# Altium schematic sheet TopLevel.SchDoc
size A4; SheetNumber: 1; SheetTotal: 8
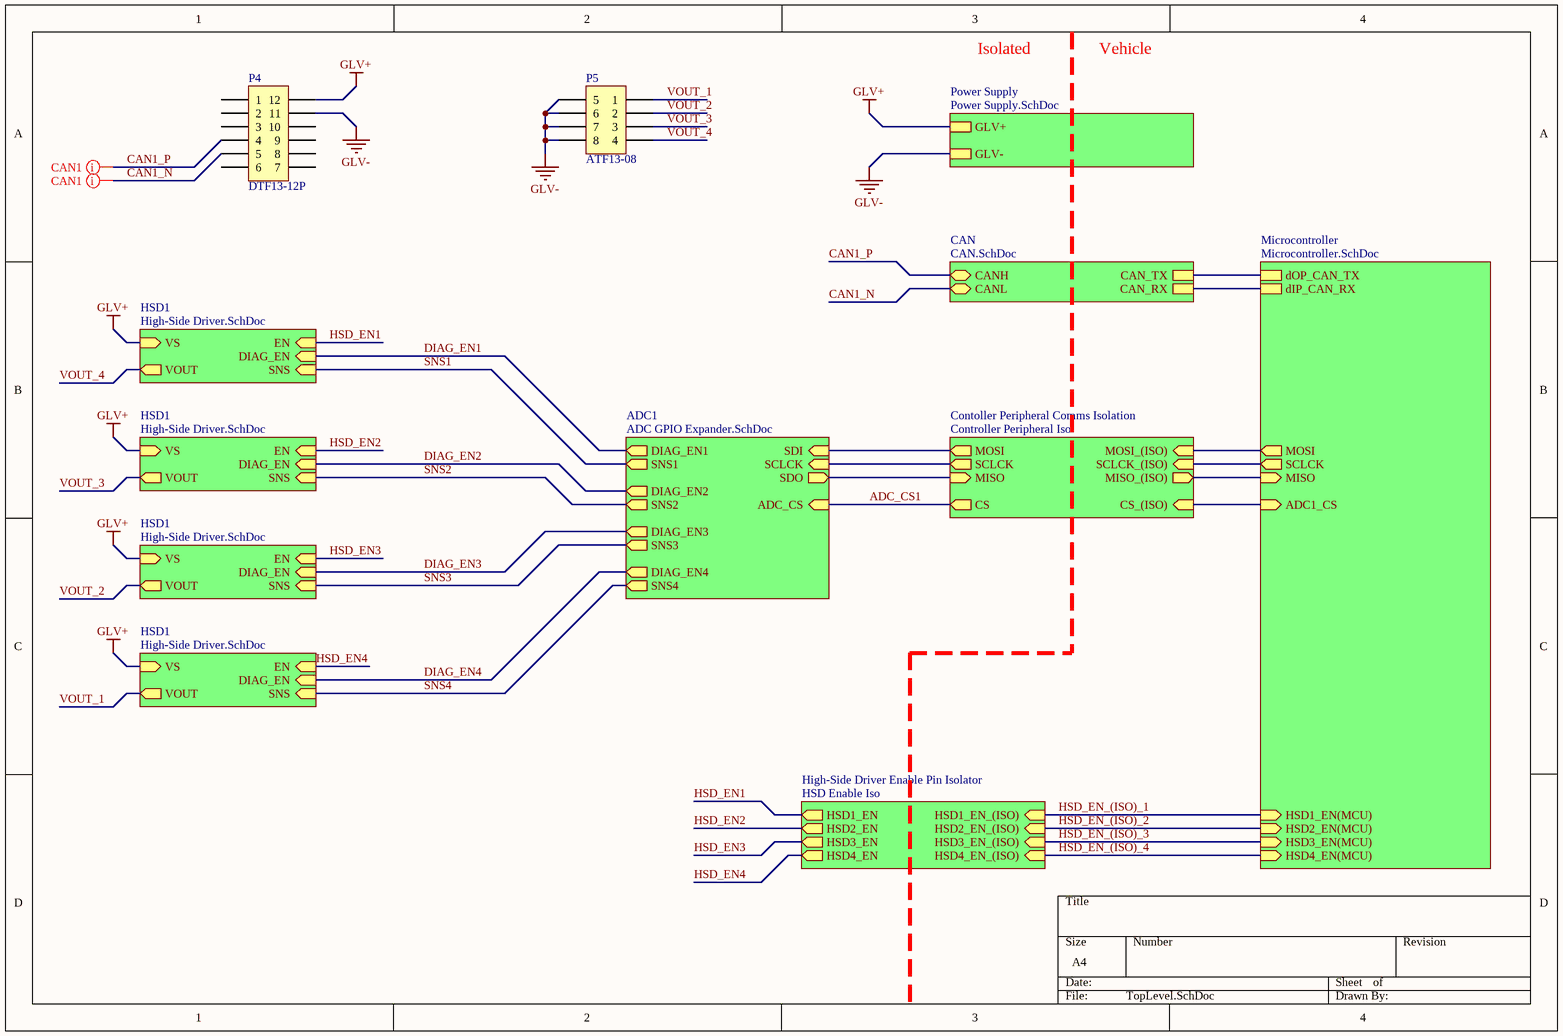
[diagram p0: TopLevel.SchDoc]

## Parts
P4  DTF13-12P  [DTF13-12P]
P5  ATF13-08  [ATF13-08]

## Sub-sheets
ADC1 = ADC GPIO Expander.SchDoc: SDO (out), SCLCK (in), SDI (in), ADC_CS (in), DIAG_EN1 (out), SNS1 (out), DIAG_EN2 (out), SNS2 (out), DIAG_EN3 (out), SNS3 (out), DIAG_EN4 (out), SNS4 (out)
CAN = CAN.SchDoc: CANH (bidir), CANL (bidir), CAN_TX, CAN_RX
Contoller Peripheral Comms Isolation = Controller Peripheral Iso: MOSI (out), SCLCK (out), MISO (in), MOSI_(ISO) (in), MISO_(ISO) (out), SCLCK_(ISO) (in), CS (out), CS_(ISO) (in)
High-Side Driver Enable Pin Isolator = HSD Enable Iso: HSD1_EN (out), HSD2_EN (out), HSD3_EN (out), HSD1_EN_(ISO) (in), HSD3_EN_(ISO) (in), HSD2_EN_(ISO) (in), HSD4_EN (out), HSD4_EN_(ISO) (in)
HSD1 = High-Side Driver.SchDoc: VS (in), EN (in), DIAG_EN (in), SNS (in), VOUT (out)
HSD1 = High-Side Driver.SchDoc: VS (in), EN (in), DIAG_EN (in), SNS (in), VOUT (out)
HSD1 = High-Side Driver.SchDoc: VS (in), EN (in), DIAG_EN (in), SNS (in), VOUT (out)
HSD1 = High-Side Driver.SchDoc: VS (in), EN (in), DIAG_EN (in), SNS (in), VOUT (out)
Microcontroller = Microcontroller.SchDoc: dOP_CAN_TX, dIP_CAN_RX, MOSI (out), MISO (in), SCLCK (out), HSD1_EN(MCU) (in), HSD2_EN(MCU) (in), HSD3_EN(MCU) (in), HSD4_EN(MCU) (in), ADC1_CS (in)
Power Supply = Power Supply.SchDoc: GLV+, GLV-

## Nets
GLV+: P4.12 ; sheet Power Supply/GLV+, sheet HSD1/VS, sheet HSD1/VS, sheet HSD1/VS, sheet HSD1/VS
GLV-: P4.11 P5.5 P5.6 P5.7 P5.8 ; sheet Power Supply/GLV-
ADC_CS1: sheet Contoller Peripheral Comms Isolation/CS, sheet ADC1/ADC_CS
CAN1_N: P4.5 ; sheet CAN/CANL
CAN1_P: P4.4 ; sheet CAN/CANH
DIAG_EN1: sheet HSD1/DIAG_EN, sheet ADC1/DIAG_EN1
DIAG_EN2: sheet HSD1/DIAG_EN, sheet ADC1/DIAG_EN2
DIAG_EN3: sheet HSD1/DIAG_EN, sheet ADC1/DIAG_EN3
DIAG_EN4: sheet HSD1/DIAG_EN, sheet ADC1/DIAG_EN4
HSD_EN1: sheet High-Side Driver Enable Pin Isolator/HSD1_EN, sheet HSD1/EN
HSD_EN2: sheet High-Side Driver Enable Pin Isolator/HSD2_EN, sheet HSD1/EN
HSD_EN3: sheet High-Side Driver Enable Pin Isolator/HSD3_EN, sheet HSD1/EN
HSD_EN4: sheet High-Side Driver Enable Pin Isolator/HSD4_EN, sheet HSD1/EN
HSD_EN_(ISO)_1: sheet High-Side Driver Enable Pin Isolator/HSD1_EN_(ISO), sheet Microcontroller/HSD1_EN(MCU)
HSD_EN_(ISO)_2: sheet High-Side Driver Enable Pin Isolator/HSD2_EN_(ISO), sheet Microcontroller/HSD2_EN(MCU)
HSD_EN_(ISO)_3: sheet High-Side Driver Enable Pin Isolator/HSD3_EN_(ISO), sheet Microcontroller/HSD3_EN(MCU)
HSD_EN_(ISO)_4: sheet High-Side Driver Enable Pin Isolator/HSD4_EN_(ISO), sheet Microcontroller/HSD4_EN(MCU)
SNS1: sheet HSD1/SNS, sheet ADC1/SNS1
SNS2: sheet HSD1/SNS, sheet ADC1/SNS2
SNS3: sheet HSD1/SNS, sheet ADC1/SNS3
SNS4: sheet HSD1/SNS, sheet ADC1/SNS4
VOUT_1: P5.1 ; sheet HSD1/VOUT
VOUT_2: P5.2 ; sheet HSD1/VOUT
VOUT_3: P5.3 ; sheet HSD1/VOUT
VOUT_4: P5.4 ; sheet HSD1/VOUT
(unnamed): sheet CAN/CAN_TX, sheet Microcontroller/dOP_CAN_TX
(unnamed): sheet CAN/CAN_RX, sheet Microcontroller/dIP_CAN_RX
(unnamed): sheet Contoller Peripheral Comms Isolation/MOSI, sheet ADC1/SDI
(unnamed): sheet Contoller Peripheral Comms Isolation/SCLCK, sheet ADC1/SCLCK
(unnamed): sheet Contoller Peripheral Comms Isolation/MISO, sheet ADC1/SDO
(unnamed): sheet Contoller Peripheral Comms Isolation/MOSI_(ISO), sheet Microcontroller/MOSI
(unnamed): sheet Contoller Peripheral Comms Isolation/MISO_(ISO), sheet Microcontroller/MISO
(unnamed): sheet Contoller Peripheral Comms Isolation/SCLCK_(ISO), sheet Microcontroller/SCLCK
(unnamed): sheet Contoller Peripheral Comms Isolation/CS_(ISO), sheet Microcontroller/ADC1_CS

Not connected (* = marked no-connect by the designer): P4 1 2 3 6 7 8 9 10

## Layout directives
differential pair: CAN1_N, CAN1_P

## Notes on the sheet
- Isolated
- Vehicle

## Library data of the parts
P4 = DTF13-12P: Positions: 12; Pitch: 4.45mm; Angle: 90; Flange: No; Contact: Copper Alloy; Part Number: DTF13-12P; Row Spacing: 4.45mm; Digikey Part Number: 1734-1861-ND; Digikey Link: https://www.digikey.com/products/en?keywords=dtf13-12pa
P5 = ATF13-08: Part Number: ATF13-08